# Altium project LTEWatch.PrjPcb (part 3 of 3)

## Sheet LTEW_Radio_Freq.SchDoc: LTEW_Radio_Freq
size 420 x 297 mm; Author: Tristan Traiber; CompanyName: MSE HES-SO; DrawnBy: Tristan Traiber; Engineer: Tristan Traiber; Organization: MSE HES-SO; Address1: HEVS; Address3: Tristan Traiber; DocumentNumber: 6; Revision: 1.0; SheetNumber: 6; SheetTotal: 6
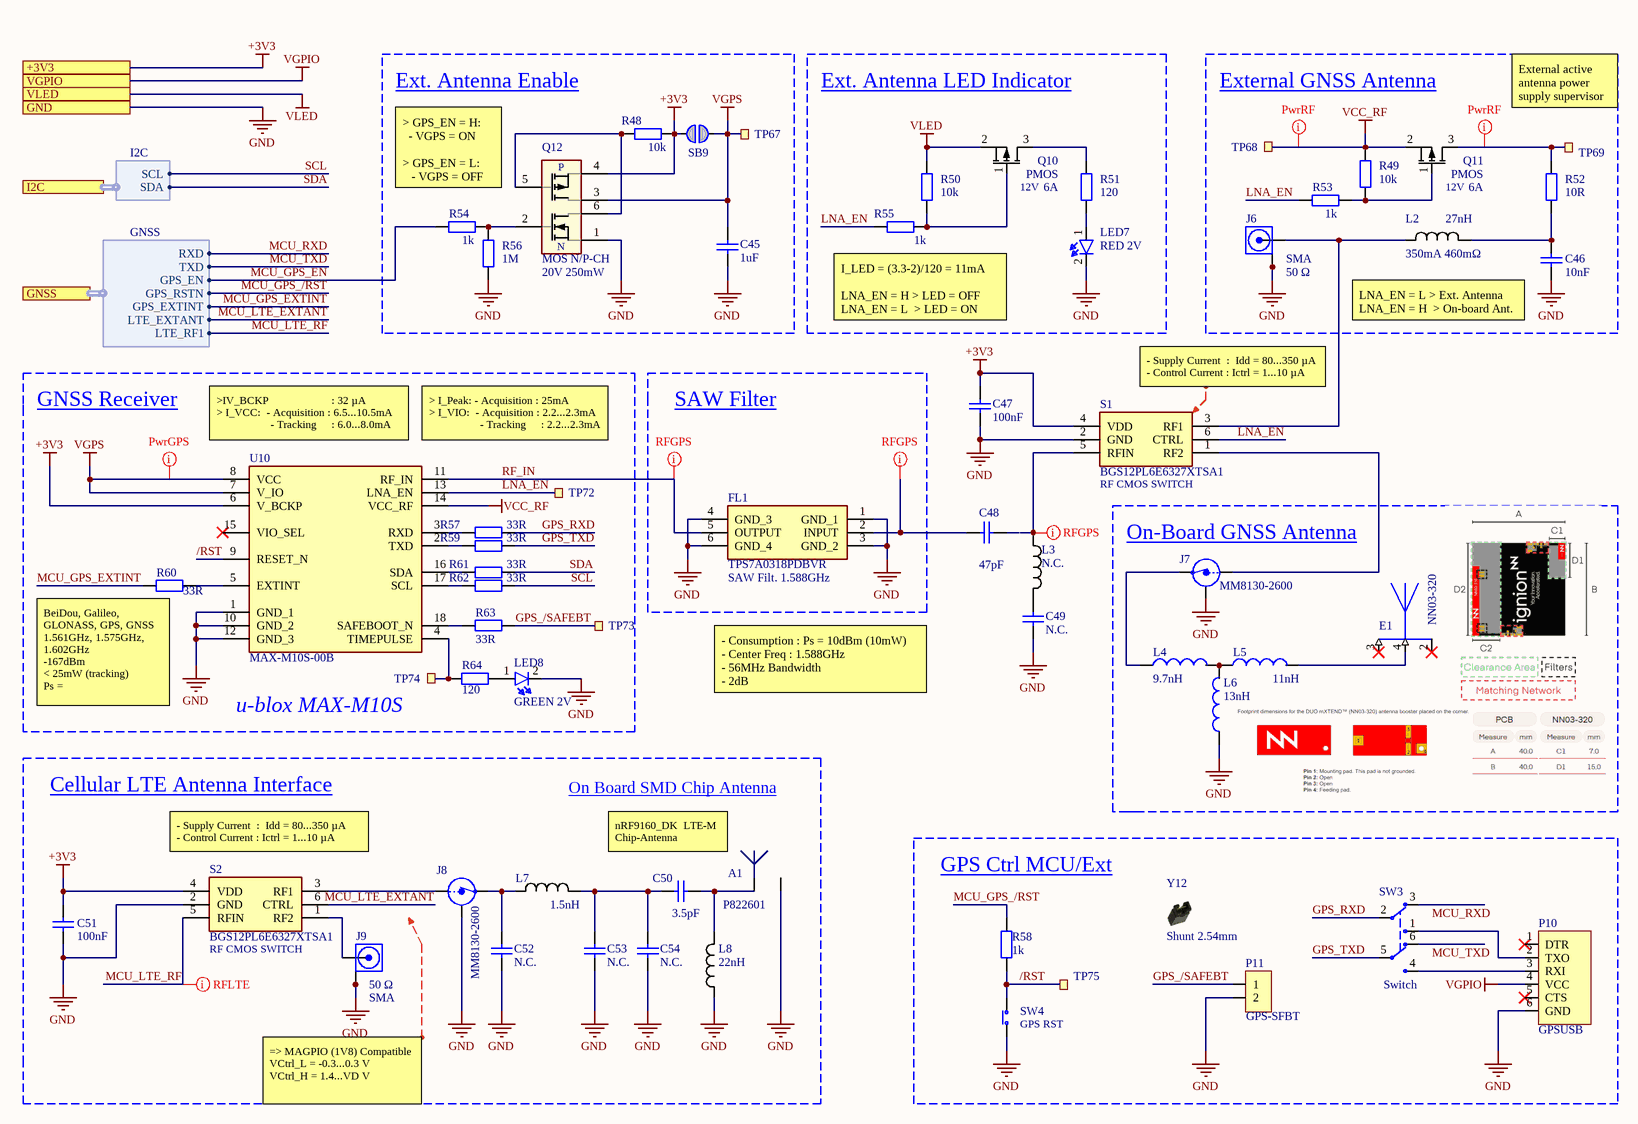
[diagram p5: LTEW_Radio_Freq.SchDoc]

### Parts
A1  P822601  [P822601]
C45  1uF  [C0603]
C46  10nF  [C0603]
C47  100nF  [C0603]
C48  47pF  [CAPC1005X55N]
C49  N.C.  [CAPC1005X55N]
C50  3.5pF  [CAPC1005X55N]
C51  100nF  [C0603]
C52  N.C.  [CAPC1005X55N]
C53  N.C.  [CAPC1005X55N]
C54  N.C.  [CAPC1005X55N]
E1  NN03-320  [XCVR_NN03-320]
FL1  TPS7A0318PDBVR  value SAW Filt. 1.588GHz  [B39162B3913U410]
J6  SMA  value 50 Ω  [73251-1350 - GNSS]
J7  MM8130-2600  [COAXIAL-SWF - GNSS]
J8  MM8130-2600  [COAXIAL-SWF - LTE]
J9  SMA  value 50 Ω  [73251-1350 - LTE]
L2  350mA 460mΩ  value 27nH  [LQG15WH0N7B02D]
L3  N.C.  [INDC1005X37N]
L4  9.7nH  [LQW15AN10NG80D]
L5  11nH  [LQW15AN10NG80D]
L6  13nH  [LQW15AN10NG80D]
L7  1.5nH  [INDC1005X37N]
L8  22nH  [LQW15AN10NG80D]
LED7  RED 2V  [LEDC1608X80N]
LED8  GREEN 2V  [LEDC1608X80N]
P10  GPSUSB  [HDR1X6 - GPS]
P11  GPS-SFBT  [HDR1X2 - GPSSAFEBOOT]
Q10  PMOS  value 12V  Value2: 6A  [SSM3J332RLFT]
Q11  PMOS  value 12V  Value2: 6A  [SSM3J332RLFT]
Q12  MOS N/P-CH  value 20V 250mW  [SOT50P160X60-6N]
R48  10k  [RES0603]
R49  10k  [RES0603]
R50  10k  [RES0603]
R51  120  [RES0603]
R52  10R  [RESC2012X60N]
R53  1k  [RES0603]
R54  1k  [RES0603]
R55  1k  [RES0603]
R56  1M  [RES0603]
R57  33R  [RES0603]
R58  1k  [RES0603]
R59  33R  [RES0603]
R60  33R  [RES0603]
R61  33R  [RES0603]
R62  33R  [RES0603]
R63  33R  [RES0603]
R64  120  [RES0603]
S1  BGS12PL6E6327XTSA1  value RF CMOS SWITCH  [BGS12WN6E6327XTSA1]
S2  BGS12PL6E6327XTSA1  value RF CMOS SWITCH  [BGS12WN6E6327XTSA1]
SB9  Solderbridge  [Solderbridge]  (value not drawn)  (no BOM)
SW3  Switch  [JS102011JAQN - GPS]
SW4  value GPS RST  [Push Button C2.5X3.0 OMRON B3U-1000P(M)-B - GPS RST]  (hidden comment: SKHUALE010)
TP67  Ø1.0mm,SMD  [TP_SMD_Ø0.8mm]  (value not drawn)  (no BOM)
TP68  Ø1.0mm,SMD  [TP_SMD_Ø0.8mm]  (value not drawn)  (no BOM)
TP69  Ø1.0mm,SMD  [TP_SMD_Ø0.8mm]  (value not drawn)  (no BOM)
TP72  Ø1.0mm,SMD  [TP_SMD_Ø0.8mm]  (value not drawn)  (no BOM)
TP73  Ø1.0mm,SMD  [TP_SMD_Ø0.8mm]  (value not drawn)  (no BOM)
TP74  Ø1.0mm,SMD  [TP_SMD_Ø0.8mm]  (value not drawn)  (no BOM)
TP75  Ø1.0mm,SMD  [TP_SMD_Ø0.8mm]  (value not drawn)  (no BOM)
U10  MAX-M10S-00B  [MAXM10S00B]
Y12  Shunt 2.54mm  [Shunt_2.54mm_Horizontal]

### Blocks framed on the sheet
Ext. Antenna Enable: C45 Q12 R48 R54 R56 SB9 TP67
Ext. Antenna LED Indicator: LED7 Q10 R50 R51 R55
External GNSS Antenna: C46 J6 L2 Q11 R49 R52 R53 TP68 TP69
SAW Filter: FL1
Cellular LTE Antenna Interface: A1 C50-C54 J8 J9 L7 L8 S2
GPS Ctrl MCU/Ext: P10 P11 R58 SW3 SW4 TP75 Y12

### Ports
+3V3, GND, GNSS (harness GNSS), I2C (harness I2C), VGPIO, VLED

### Harnesses
I2C: SCL, SDA
GNSS: RXD, TXD, LTE_EXTANT, GPS_EN, LTE_RF1, GPS_RSTN, GPS_EXTINT

### Nets
+3V3: C47.2 C51.2 Q12.4(S2) R48.1 S1.4(VDD) S2.4(VDD) SB9.1 U10.6(V_BCKP) ; port +3V3
GND: A1.2 C45.1 C46.1 C47.1 C49.1 C51.1 C52.1 C53.1 C54.1 FL1.1(GND_1) FL1.3(GND_2) FL1.4(GND_3) FL1.6(GND_4) J6.1 J6.2 J6.3 J6.4 J7.2(Shield) J8.2(Shield) J9.1 J9.2 J9.3 J9.4 L6.1 L8.2 LED7.2(K) LED8.2(K) P10.6(GND) P11.2 Q12.1(S1) R56.1 S1.2(GND) S2.2(GND) SW4.2(COM) U10.1(GND_1) U10.10(GND_2) U10.12(GND_3) ; port GND
VCC_RF: Q11.2(S) R49.2 TP68.1 U10.14(VCC_RF)
VGPIO: P10.4(VCC) ; port VGPIO
VGPS: C45.2 Q12.3(D2) SB9.2 TP67.1 U10.7(V_IO) U10.8(VCC)
VLED: Q10.2(S) R50.2 ; port VLED
/RST: R58.1 SW4.1(N.O) TP75.1 U10.9(RESET_N)
GPS_/SAFEBT: P11.1 R63.2 TP73.1
GPS_RXD: R57.2 SW3.2(COM-1)
GPS_TXD: R59.2 SW3.5(COM-2)
LNA_EN: R53.1 R55.1 S1.6(CTRL) TP72.1 U10.13(LNA_EN)
MCU_GPS_/RST: R58.2 ; port GNSS.GPS_RSTN  [project net GPS-/RST]
MCU_GPS_EN: R54.1 ; port GNSS.GPS_EN  [project net GPS-EN]
MCU_GPS_EXTINT: R60.1 ; port GNSS.GPS_EXTINT  [project net GPS_EXT_INT]
MCU_LTE_EXTANT: S2.6(CTRL) ; port GNSS.LTE_EXTANT  [project net LTE_EXT_ANT]
MCU_LTE_RF: S2.5(RFIN) ; port GNSS.LTE_RF1  [project net LTE_RF1]
MCU_RXD: SW3.3(N.C-1) ; port GNSS.RXD  [project net GPS-RXD]
MCU_TXD: SW3.6(N.C-2) ; port GNSS.TXD  [project net GPS-TXD]
RF_IN: FL1.5(OUTPUT) U10.11(RF_IN)
SCL: R62.2 ; port I2C.SCL  [project net P0.09/SCL]
SDA: R61.2 ; port I2C.SDA  [project net P0.08/SDA]
NetA1_1: A1.1 C50.2 L8.1
NetC46_2: C46.2 L2.1 R52.1
NetC48_1: C48.1 FL1.2(INPUT)
NetC48_2: C48.2 L3.1 S1.5(RFIN)
NetC49_2: C49.2 L3.2
NetC50_1: C50.1 C53.2 C54.2 L7.1
NetC52_2: C52.2 J8.3(OUT) L7.2
NetE1_4: E1.4(FEED_GNSS) L5.2
NetJ6_5: J6.5 L2.2 S1.3(RF1)
NetJ7_1: J7.1(IN) S1.1(RF2)
NetJ7_3: J7.3(OUT) L4.1
NetJ8_1: J8.1(IN) S2.3(RF1)
NetJ9_5: J9.5 S2.1(RF2)
NetL4_2: L4.2 L5.1 L6.2
NetLED7_1: LED7.1(A) R51.1
NetLED8_1: LED8.1(A) R64.1
NetP10_2: P10.2(TXO) SW3.1(N.O-1)
NetP10_3: P10.3(RXI) SW3.4(N.O-2)
NetQ10_1: Q10.1(G) R50.1 R55.2
NetQ10_3: Q10.3(D) R51.2
NetQ11_1: Q11.1(G) R49.1 R53.2
NetQ11_3: Q11.3(D) R52.2 TP69.1
NetQ12_2: Q12.2(G1) R54.2 R56.2
NetQ12_5: Q12.5(G2) Q12.6(D1) R48.2
NetR57_1: R57.1 U10.3(RXD)
NetR59_1: R59.1 U10.2(TXD)
NetR60_2: R60.2 U10.5(EXTINT)
NetR61_1: R61.1 U10.16(SDA)
NetR62_1: R62.1 U10.17(SCL)
NetR63_1: R63.1 U10.18(SAFEBOOT_N)
NetR64_2: R64.2 TP74.1 U10.4(TIMEPULSE)

Not connected (* = marked no-connect by the designer): E1 2(GROUND)* 3(FEED_BLUETOOTH)*; P10 1(DTR)* 5(CTS)*; U10 15(VIO_SEL)*

### Layout directives
mark named PwrGPS: VGPS
mark named RFLTE: LTE_RF1
mark named PwrRF: NetQ11_3, VCC_RF
mark named RFGPS: NetC48_1, NetC48_2, RF_IN

### Notes on the sheet
- (near TP69) External active antenna power supply supervisor
- > GPS_EN = H:
  - VGPS = ON
  > GPS_EN = L:
  - VGPS = OFF
- (near R55) I_LED = (3.3-2)/120 = 11mA
  LNA_EN = H > LED = OFF
  LNA_EN = L  > LED = ON
- LNA_EN = L > Ext. Antenna
  LNA_EN = H  > On-board Ant.
- (near S1) - Supply Current  :  Idd = 80...350 µA
  - Control Current : Ictrl = 1...10 µA
- GNSS Receiver
- (near U10) >IV_BCKP                     : 32 µA
  > I_VCC:  - Acquisition : 6.5...10.5mA
  - Tracking     : 6.0...8.0mA
- > I_Peak: - Acquisition : 25mA
  > I_VIO:  - Acquisition : 2.2...2.3mA
  - Tracking     : 2.2...2.3mA
- (near J7) On-Board GNSS Antenna
- (near R60) BeiDou, Galileo, GLONASS, GPS, GNSS
  1.561GHz, 1.575GHz, 1.602GHz
  -167dBm
  < 25mW (tracking)
  Ps =
- u-blox MAX-M10S
- - Consumption : Ps = 10dBm (10mW)
  - Center Freq : 1.588GHz
  - 56MHz Bandwidth
  - 2dB
- (near S2) - Supply Current  :  Idd = 80...350 µA
  - Control Current : Ictrl = 1...10 µA
- On Board SMD Chip Antenna
- nRF9160_DK  LTE-M Chip-Antenna
- Title
- Size:
- Date:
- A3
- Number:
- Time:
- Revision:
- Sheet
- of
- File:
- (in symbol C_47p_0402) /
- (in symbol MOS_NP_3) P; N

### Library data of the parts
A1 = Ant_nRF_9160DK: ANTENNA PRESTTA OCTABAND LTE; Part number IPS: 00000009001; Manufacturer_Name: Ethertronics; Note: N.A.; Pad Count: 2; Part Number: P822601; Footprint Doc: P822601; LatestRevisionDate: 2017-07-28; Published: 2017-07-28; Value: P822601; Artikkelnr Noca: N.A.; ComponentLink1URL: N.A.; ComponentLink1Description: Datasheet; ComponentLink2URL: N.A.; ComponentLink2Description: Supplier link; HelpURL: http://www.ethertronics.com/wp-content/uploads/2016/11/Prestta-P822601-P822602-Standard-Cellular-Octa-Band-20160904.pdf; Supplier 1: Digi-Key; Supplier Part Number 1: 939-1057-1-ND; PartId: 100700043; Component Class: Antennas; Manufacturer_Part_Number: P822601; Unit Price: 3.41
C45 = C_1u: 1 µF ±10% 25V Ceramic Capacitor X7R 0603 (1608 Metric); Manufacturer_Part_Number: CL10B105KA8NNNC; Manufacturer_Name: Samsung Electro-Mechanics; Supplier 1: Mouser; Supplier Part Number 1: 187-CL10B105KA8NNNC; Value: 1uF; Price Unit: 0.10
C46 = C_10n: 10000 pF ±5% 25V Condensateurs céramique C0G, NP0 0603 (1608 métrique); Manufacturer_Part_Number: C1608C0G1E103J080AA; Manufacturer_Name: TDK Corporation; Value: 10nF; Supplier 1: Digi-Key; Supplier Part Number 1: 445-2664-1-ND; Unit Price: 0.270
C47 = C_100n_0402: 0.1 µF ±10% 25V Ceramic Capacitor X7R 0402 (1005 Metric); Manufacturer_Part_Number: CL05B104KA5NNNC; Manufacturer_Name: Samsung Electro-Mechanics; Value: 100nF; Unit Price: 0.10; Supplier 1: Digi-Key; Supplier Part Number 1: 1276-6720-1-ND
C48 = C_47p_0402: 47 pF ±5% 25V Ceramic Capacitor C0G, NP0 0402 (1005 Metric); Manufacturer_Part_Number: 0402N470J250CT; Manufacturer_Name: KEMET; Value: 47pF; Unit Price: 0.130; Supplier 1: Digi-Key; Supplier Part Number 1: 1292-1324-1-ND
C49 C52-C54 = C_NC_0402: NC; Value: N.C.
C50 = C_0402_3.5p: 3.5 pF ±0,1pF 50V Condensateurs céramique C0G, NP0 0402 (1005 métrique); Manufacturer_Part_Number: GJM1555C1H3R5BB01D; Manufacturer_Name: Murata Electronics; Value: 3.5pF; Supplier 1: Mouser; Supplier Part Number 1: 81-GJM1555C1H3R5BB1D; Unit Price: 0.180
C51 = C_100n: 0.1 µF ±10% 25V Condensateurs céramique X7R 0603 (1608 métrique); Manufacturer_Part_Number: CL10B104KA8NNNC; Manufacturer_Name: Samsung Electro-Mechanics; Supplier 1: Digi-Key; Value: 100nF; Supplier Part Number 1: 1276-1006-1-ND; Unit Price: 0.10
E1 = ANT_GNSS: Dual port antenna booster for GNSS, Bluetooth, 5G and UWB (1561 - 1606MHz, 2400 - 2500MHz, 3400 - 3800MHz, 3100 - 4800MHz and 6000 - 10600 MHz).; Manufacturer_Name: Ignion; SnapEDA_Link: https://www.snapeda.com/parts/NN03-320/Fractus%20Antennas%20S.L./view-part/4257250/?ref=snap; Purchase-URL: https://pricing.snapeda.com/search/part/NN03-320/?ref=eda; Availability: In Stock; MP: NN03-320; Value: *; Package: None; Check_prices: https://www.snapeda.com/parts/NN03-320/Fractus%20Antennas%20S.L./view-part/4257250/?ref=eda; Supplier 1: Digi-Key; Supplier Part Number 1: 2115-NN03-320CT-ND; Manufacturer_Part_Number: NN03-320; Unit Price: 0.91
FL1 = IC_SAW_FILTER: 1.588GHz Frequency GPS RF SAW Filter (Surface Acoustic Wave) 2dB 56MHz Bandwidth 6-SMD, No Lead; Manufacturer_Name: Qualcomm (RF front-end (RFFE) filters); Datasheet Link: https://www.mouser.at/datasheet/2/842/B3913-1092487.pdf; Height: 1.225mm; Manufacturer_Part_Number: B39162B3913U410; Supplier 1: Digi-Key; Supplier Part Number 1: B39162B3913U410CT-ND; Unit Price: 1.58
J6 J9 = CONN_SMA: SMA Connector Jack, Female Socket 50Ohm Surface Mount Solder; Manufacturer_Name: Molex; Manufacturer_Part_Number: 73251-1352; Datasheet Link: http://www.molex.com/webdocs/datasheets/pdf/en-us//0732511352_RF_COAX_CONNECTORS.pdf; Supplier 1: Digi-Key; Supplier Part Number 1: WM9357-ND; Unit Price: 5.02
J7 J8 = MM8130-2600: Coaxial Connector with Switch; Manufacturer: Murata; Manufacturer Part Number: MM8130-2600; Value: MM8130-2600; ComponentLink1URL: N.A.; ComponentLink1Description: Datasheet; ComponentLink2URL: N.A.; ComponentLink2Description: Supplier link; Supplier 1: Digi-Key; Supplier Part Number 1: 490-4981-1-ND; Unit Price: 0.34
L2 = L_27n: 27 nH Unshielded Multilayer Inductor 350 mA 460mOhm Max 0402 (1005 Metric); Manufacturer_Name: Murata Electronics; Manufacturer_Part_Number: LQG15HS27NJ02D; Datasheet Link: https://psearch.en.murata.com/inductor/product/LQG15HS27NJ02%23.html; Height: 0.55mm; Supplier 1: Digi-Key; Supplier Part Number 1: 490-2628-1-ND; Unit Price: 0.10
L3 = L_0402_NC
L4 = L_9.7n: 9.7 nH Non blindé Bobiné Inducteur 1.4 A 81mOhms maxi 0402 (1005 métrique); Manufacturer_Name: Murata Electronics; Manufacturer_Part_Number: LQW15AN9N7G80D; Datasheet Link: https://datasheet.datasheetarchive.com/originals/distributors/Datasheets_SAMA/fbc87eb480f1703e4073bb137d632104.pdf; Height: 0.6mm; Supplier 1: Mouser; Supplier Part Number 1: 81-LQW15AN9N7G80D; Value: 9.7nH; Unit Price: 0.25
L5 = L_11n: 11 nH Unshielded Drum Core, Wirewound Inductor 1.4 A 65mOhm 0402 (1005 Metric); Manufacturer_Name: Delta Electronics/Components; Manufacturer_Part_Number: 0402HP-110EGTS; Datasheet Link: https://psearch.en.murata.com/inductor/product/LQW18AN11NG8Z%23.html; Height: 1mm; Value: 11nH; Supplier 1: Digi-Key; Supplier Part Number 1: 2035-1078-1-ND; Unit Price: 0.24
L6 = L_13n: 13 nH Unshielded Drum Core, Wirewound Inductor 870 mA 140mOhm 0402 (1005 Metric); Manufacturer_Name: Delta Electronics/Components; Manufacturer_Part_Number: 0402HP-130EGTS; Datasheet Link: https://psearch.en.murata.com/inductor/product/LQW18AN11NG8Z%23.html; Height: 1mm; Value: 13nH; Supplier 1: Digi-Key; Supplier Part Number 1: 2035-1525-1-ND; Unit Price: 0.24
L7 = L_0402_1.5n: 1.5 nH Non blindé Couche mince Inducteur 700 mA 250mOhms maxi 0402 (1005 métrique); Manufacturer_Name: Abracon LLC; Manufacturer_Part_Number: ATFC-0402-1N5B-T; Value: 1.5nH; Supplier 1: Digi-Key; Supplier Part Number 1: 535-10356-1-ND; Unit Price: 0.10
L8 = L_0402_22n: 22 nH Non blindé Bobiné Inducteur 780 mA 202mOhms maxi 0402 (1005 métrique); Manufacturer_Name: Murata Electronics; Manufacturer_Part_Number: LQW15AN22NG80D; Value: 22nH; Supplier 1: Digi-Key; Supplier Part Number 1: 490-7628-1-ND; Unit Price: 0.25
LED7 = LED_R: Red 625nm LED Indication - Discrete 2V 0603 (1608 Metric); Manufacturer_Name: QT Brightek (QTB); Manufacturer_Part_Number: 150060RS75000; Datasheet Link: http://www.qt-brightek.com/datasheet/QBLP617_series.pdf; Height: 1.3mm; Supplier 1: Digi-Key; Supplier Part Number 1: 732-4978-1-ND; Unit Price: 0.15
LED8 = LED_G: Green 570nm LED Indication - Discrete 2V 0603 (1608 Metric); Manufacturer_Name: QT Brightek (QTB); Manufacturer_Part_Number: 150060VS75000; Datasheet Link: http://www.qt-brightek.com/datasheet/QBLP617_series.pdf; Height: 1.3mm; Supplier 1: Digi-Key; Supplier Part Number 1: 732-4980-1-ND; Unit Price: 0.15
P10 = H_1x6: Header, 6-Pin; Manufacturer_Name: Würth Elektronik; Manufacturer_Part_Number: 61300611121; Publisher: Altium Limited; Supplier 1: Digi-Key; Supplier Part Number 1: 732-5319-ND; Unit Price: 0.35
P11 = H_2POS: Header, 2-Pin; Manufacturer_Part_Number: 10129378-902001BLF; Manufacturer_Name: Amphenol ICC (FCI); Supplier 1: Mouser; Supplier Part Number 1: 649-1012937890201BLF; Unit Price: 0.10
Q10 Q11 = MOS-P: P-Channel 12 V 6A (Ta) 1W (Ta) Surface Mount SOT-23F; Manufacturer_Name: Toshiba; Manufacturer_Part_Number: SSM3J338R; Datasheet Link: http://toshiba.semicon-storage.com/info/docget.jsp?did=30384&prodName=SSM3J338R; Supplier 1: Digi-Key; Supplier Part Number 1: SSM3J338RLFCT-ND; Unit Price: 0.38
Q12 = MOS_NP_3: Mosfet Array N and P-Channel 20V 485mA, 370mA 250mW Surface Mount SC-89 (SOT-563F); Manufacturer_Name: Vishay; Manufacturer_Part_Number: SI1016X-T1-GE3; Datasheet Link: https://componentsearchengine.com/Datasheets/1/SI1016X-T1-GE3.pdf; Height: 0.6mm; Supplier 1: Digi-Key; Supplier Part Number 1: SI1016X-T1-GE3CT-ND; Unit Price: 0.48
R48-R50 = R_10k: 10 kOhms ±1% 0.1W, 1/10W Chip Resistor 0603 (1608 Metric) Moisture Resistant Thick Film; Manufacturer_Part_Number: RC0805FR-0710KL; Manufacturer_Name: YAGEO; Supplier 1: Digi-Key; Supplier Part Number 1: 311-10.0KHRCT-ND; Value: 10k; Unit Price: 0..10
R51 R64 = R_120: 1 MOhms ±1% 0.1W, 1/10W Chip Resistor 0603 (1608 Metric) Automotive AEC-Q200 Thick Film; Manufacturer_Part_Number: CRGCQ0603F120R; Manufacturer_Name: YAGEO; Value: 120; Supplier 1: Digi-Key; Supplier Part Number 1: A129677CT-ND; Unit Price: 0.10
R52 = R_10: 10 Ohms ±5% 0.25W, 1/4W Chip Resistor 0805 (2012 Metric) Automotive AEC-Q200 Thick Film; Manufacturer_Part_Number: RK73B2ATTD100J; Manufacturer_Name: YAGEO; Supplier 1: Digi-Key; Supplier Part Number 1: 2019-RK73B2ATTD100JCT-ND; Value: 10R; Unit Price: 0.10
R53-R55 R58 = R_1k: 1 kOhms ±1% 0.1W, 1/10W Chip Resistor 0603 (1608 Metric) Moisture Resistant Thick Film; Manufacturer_Part_Number: RC0603FR-071KL; Manufacturer_Name: YAGEO; Value: 1k; Supplier 1: Digi-Key; Supplier Part Number 1: 311-1.00KHRCT-ND; Unit Price: 0.10
R56 = R_1M: 1 MOhms ±1% 0.1W, 1/10W Chip Resistor 0603 (1608 Metric) Automotive AEC-Q200 Thick Film; Manufacturer_Part_Number: ERJ-3EKF1004V; Manufacturer_Name: YAGEO; Value: 1M; Supplier 1: Digi-Key; Supplier Part Number 1: P1.00MHCT-ND; Unit Price: 0.10
R57 R59-R63 = R_33: 33 Ohms ±1% 0.1W, 1/10W Chip Resistor 0603 (1608 Metric) Thin Film; Manufacturer_Part_Number: RT0603FRE0733RL; Manufacturer_Name: YAGEO; Value: 33R; Supplier 1: Digi-Key; Supplier Part Number 1: 13-RT0603FRE0733RLCT-ND; Unit Price: 0.10
S1 S2 = SW_RF_SWITCH: RF Switch IC WLAN SPDT 50Ohm PG-TSNP-6-10; Manufacturer_Name: Infineon Technologies; Supplier 1: Digi-Key; Manufacturer_Part_Number: BGS12PL6E6327XTSA1; Supplier Part Number 1: BGS12PL6E6327XTSA1CT-ND; Unit Price: 0.50
SB9 = Solderbridge: Manufacturer: N.A.; Pad Count: 2; Part Number: Solderbridge; Manufacturer Part Number: N.A.; LatestRevisionDate: 2009-12-14; Published: 2009-12-14; Value: Solderbridge; Note: N.A.; Artikkelnr Noca: N.A.; Footprint Doc: Solderbridge; Part number IPS: N.A.; ComponentLink1URL: N.A.; ComponentLink1Description: Datasheet; ComponentLink2URL: N.A.; ComponentLink2Description: Supplier link; HelpURL: N.A.; Supplier 1: N.A.; Supplier Part Number 1: N.A.; Supplier 2: N.A.; Supplier Part Number 2: N.A.; PartId: 100500458; Component Class: Connectors
SW3 = Switch-Slide-RA-J-Lead-DPDT-8.5x3.5mm_C&K: SMD slide Switch (ON-ON); Manufacturer Part Number: JS202011JAQN; Manufacturer_Name: C&K; Value: Switch; ComponentLink1URL: N.A.; ComponentLink1Description: Datasheet; ComponentLink2URL: N.A.; ComponentLink2Description: Supplier link; Component Class: Switches; Supplier 1: Digi-Key; Supplier Part Number 1: CKN10722CT-ND; Unit Price: 0.66
SW4 = SW_SMD_PB: Tactile Switch, SPNO, SMD, 160gf, 6.2x6.3x2.5mm; Manufacturer_Name: Alps Alpine; Pad Count: 4; ComponentLink1URL: N.A.; ComponentLink1Description: Datasheet; ComponentLink2URL: N.A.; ComponentLink2Description: Supplier link; Supplier Part Number 2: 1333652; PartId: 101500001; Component Class: Switches; Supplier 1: Mouser; Supplier Part Number 1: 688-SKHUALE010; Manufacturer_Part_Number: SKHUALE010; Unit Price: 0.76; Supplier 2: Farnell
TP67-TP69 TP72-TP75 = TP_SMD: 0.8 mm circular SMD testpad; Part Number: TP_SMD_Ø1.0MM; Manufacturer: Nordic Semiconductor; Manufacturer Part Number: N.A.; Pad Count: 1; ComponentLink1URL: N.A.; ComponentLink1Description: Datasheet; ComponentLink2URL: N.A.; ComponentLink2Description: Supplier link; HelpURL: N.A.; Footprint Doc: TP_SMD_Ø1.0mm; LatestRevisionDate: 2013-06-11; Published: 2013-06-11; Value: Ø1.0mm,SMD; Note: N.A.; Supplier 1: N.A.; Supplier Part Number 1: N.A.; Supplier 2: N.A.; Supplier Part Number 2: N.A.; Artikkelnr Noca: N.A.; Part number IPS: N.A.; PartId: 100500475; Component Class: Connectors
U10 = IC_MAX-M10S: MAX-M10 RF Receiver BeiDou, Galileo, GLONASS, GPS, GNSS 1.561GHz, 1.575GHz, 1.602GHz -167dBm 921.6kbps; Manufacturer_Name: U-Blox; Datasheet Link: https://content.u-blox.com/sites/default/files/MAX-M10S_IntegrationManual_UBX-20053088.pdf; Height: 2.7mm; Manufacturer_Part_Number: MAX-M10S-00B; Supplier 1: Mouser; Supplier Part Number 1: 377-MAX-M10S-00B; Unit Price: 20.79
Y12 = SHUNT JUMPER 2.54mm BLACK GOLD Horizontal: Shunt Jumper 2.54mm Black; Manufacturer Part Number: SPC02SYAN; Manufacturer_Name: Sullins Connector Solutions; ComponentLink1URL: N.A.; ComponentLink1Description: Datasheet; ComponentLink2URL: N.A.; ComponentLink2Description: Supplier link; Footprint Doc: SHUNT JUMPER 2.54mm; Value: Shunt 2.54mm; Supplier 1: Digi-Key; Supplier Part Number 1: S9001-ND; Component Class: Connectors; Unit Price: 0.10

## Nets that join several sheets
+3V3: LTEW_Power_Supply (7 pins), LTEW_nRF9160 (9 pins), LTEW_User_Interface (12 pins), LTEW_Radio_Freq (8 pins)
GND: LTEW_Power_Supply (33 pins), LTEW_WPC_RCVR (11 pins), LTEW_nRF9160 (85 pins), LTEW_User_Interface (35 pins), LTEW_Radio_Freq (37 pins)
VBUS: LTEW_Power_Supply (C24.1 P12.1 TP62.1), LTEW_WPC_RCVR (6 pins), LTEW_nRF9160 (D1.4 FB2.2 P1.2 SB1.2)
VGPIO: LTEW_Power_Supply (P7.2 TP60.1), LTEW_nRF9160 (7 pins), LTEW_User_Interface (R26.2 R27.2 R28.2 R29.2), LTEW_Radio_Freq (P10.4)
VLED: LTEW_Power_Supply (P6.2 R25.1 TP57.1), LTEW_WPC_RCVR (LED9.1), LTEW_User_Interface (R34.2 R36.2 R38.2 R41.2), LTEW_Radio_Freq (Q10.2 R50.2)
/INT: LTEW_Power_Supply (U6.A1), LTEW_nRF9160 (TP30.1 U2.18)
/MCU_DISP_EN: LTEW_nRF9160 (TP27.1 U2.84), LTEW_User_Interface (Q4.1 R39.2)
BAT_LVL: LTEW_Power_Supply (5 pins), LTEW_nRF9160 (TP28.1 U2.20)
BAT_LVL_EN: LTEW_Power_Supply (U7.B2), LTEW_nRF9160 (TP29.1 U2.19)
BAT_TSMR: LTEW_Power_Supply (J4.3 SB5.1 TP61.1 U6.D1), LTEW_nRF9160 (5 pins)
BTN0: LTEW_nRF9160 (TP40.1 U2.30), LTEW_User_Interface (R30.1)
BTN1: LTEW_nRF9160 (TP39.1 U2.29), LTEW_User_Interface (R31.1)
BTN2: LTEW_nRF9160 (TP41.1 U2.28), LTEW_User_Interface (R32.1)
BTN3: LTEW_nRF9160 (TP42.1 U2.26), LTEW_User_Interface (R33.1)
D2COM: LTEW_nRF9160 (TP37.1 U2.100), LTEW_User_Interface (M1.5)
D2M1: LTEW_nRF9160 (TP34.1 U2.2), LTEW_User_Interface (M1.4)
D2M4: LTEW_nRF9160 (TP7.1 U2.99), LTEW_User_Interface (M1.6)
D3COM: LTEW_nRF9160 (TP9.1 U2.96), LTEW_User_Interface (M1.8)
D3M1: LTEW_nRF9160 (TP8.1 U2.97), LTEW_User_Interface (M1.7)
D3M4: LTEW_nRF9160 (TP10.1 U2.95), LTEW_User_Interface (M1.9)
DISP_EXT_COMIN: LTEW_nRF9160 (TP26.1 U2.83), LTEW_User_Interface (Q9.1 R47.2)
DISP_SCS: LTEW_nRF9160 (TP24.1 U2.86), LTEW_User_Interface (G2.5 J5.3)
GPS-/RST: LTEW_nRF9160 (TP6.1 U2.42), LTEW_Radio_Freq (R58.2)
GPS-EN: LTEW_nRF9160 (P3.1 R8.2 U2.93), LTEW_Radio_Freq (R54.1)
GPS-RXD: LTEW_nRF9160 (TP5.1 U2.40), LTEW_Radio_Freq (SW3.3)
GPS-TXD: LTEW_nRF9160 (TP4.1 U2.39), LTEW_Radio_Freq (SW3.6)
GPS_EXT_INT: LTEW_nRF9160 (C18.2 Q1.3 TP51.1), LTEW_Radio_Freq (R60.1)
LTE_EXT_ANT: LTEW_nRF9160 (TP21.1 U2.55), LTEW_Radio_Freq (S2.6)
LTE_RF1: LTEW_nRF9160 (U2.61), LTEW_Radio_Freq (S2.5)
M0: LTEW_nRF9160 (TP32.1 U2.25), LTEW_User_Interface (U9.16)
M1: LTEW_nRF9160 (TP31.1 U2.24), LTEW_User_Interface (U9.4)
M2: LTEW_nRF9160 (TP33.1 U2.23), LTEW_User_Interface (U9.8)
MCU_DISP_SCLK: LTEW_nRF9160 (AC1.10 P4.3 TP15.1 U2.88), LTEW_User_Interface (G2.2 J5.1)
MCU_DISP_SI: LTEW_nRF9160 (AC1.2 P4.2 TP16.1 U2.89), LTEW_User_Interface (G2.1 J5.2)
P0.08/SDA: LTEW_Power_Supply (U6.C1), LTEW_nRF9160 (P13.2 R1.1 TP1.1 U2.15), LTEW_Radio_Freq (R61.2)
P0.09/SCL: LTEW_Power_Supply (U6.B1), LTEW_nRF9160 (P13.1 R2.1 TP2.1 U2.16), LTEW_Radio_Freq (R62.2)
VWPC: LTEW_Power_Supply (C25.2 U6.A2), LTEW_WPC_RCVR (R74.1)